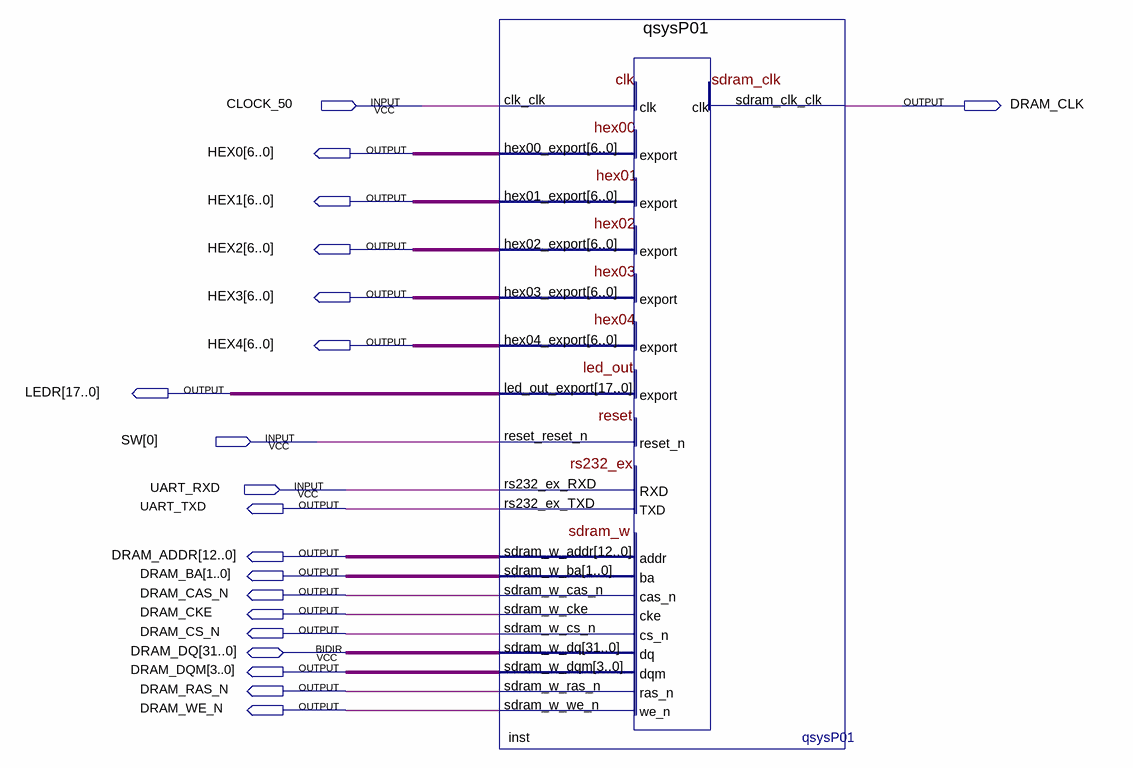
[diagram p0: schematic sheet]
// Quartus schematic project01.bdf as structural Verilog: 1 symbols, 20 pins
module project01 (
  input  CLOCK_50,
  input  [0:0] SW,
  input  UART_RXD,
  inout  [31:0] DRAM_DQ,
  output DRAM_CLK,
  output [6:0] HEX0,
  output [6:0] HEX1,
  output [6:0] HEX2,
  output [6:0] HEX3,
  output [6:0] HEX4,
  output [17:0] LEDR,
  output UART_TXD,
  output [12:0] DRAM_ADDR,
  output [1:0] DRAM_BA,
  output DRAM_CAS_N,
  output DRAM_CKE,
  output DRAM_CS_N,
  output [3:0] DRAM_DQM,
  output DRAM_RAS_N,
  output DRAM_WE_N
);

  qsysP01 inst (
    .clk_clk(CLOCK_50), .reset_reset_n(SW[0]), .rs232_ex_RXD(UART_RXD), .hex00_export(HEX0),
    .hex01_export(HEX1), .hex02_export(HEX2), .hex03_export(HEX3), .hex04_export(HEX4),
    .led_out_export(LEDR), .rs232_ex_TXD(UART_TXD), .sdram_clk_clk(DRAM_CLK), .sdram_w_addr(DRAM_ADDR),
    .sdram_w_ba(DRAM_BA), .sdram_w_cas_n(DRAM_CAS_N), .sdram_w_cke(DRAM_CKE), .sdram_w_cs_n(DRAM_CS_N),
    .sdram_w_dqm(DRAM_DQM), .sdram_w_ras_n(DRAM_RAS_N), .sdram_w_we_n(DRAM_WE_N), .sdram_w_dq(DRAM_DQ));
endmodule
